# EAGLE design sense_pcb_d (EAGLE 9.6.2)
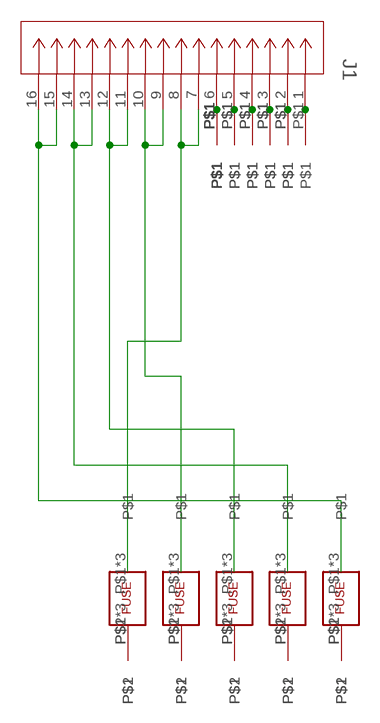
[diagram p0: schematic, sheet 1]

## Parts
J1  DF11-16DP-2DSA(01)  [CONN_DF11-16DP-2DSA(01)_HIR]
U$1  FUSE  [FUSE_PADS]
U$2  FUSE  [FUSE_PADS]
U$3  FUSE  [FUSE_PADS]
U$4  FUSE  [FUSE_PADS]
U$5  FUSE  [FUSE_PADS]
U$6  BB_CONTACT  [BB_CONTACT]
U$7  BB_CONTACT  [BB_CONTACT]
U$8  BB_CONTACT  [BB_CONTACT]
U$9  BB_CONTACT  [BB_CONTACT]
U$10  BB_CONTACT  [BB_CONTACT]
U$12  THERM_PIN  [THERM_PIN]
U$13  THERM_PIN  [THERM_PIN]
U$14  THERM_PIN  [THERM_PIN]
U$15  THERM_PIN  [THERM_PIN]
U$16  THERM_PIN  [THERM_PIN]
U$17  THERM_PIN  [THERM_PIN]
U$18  THERM_PIN  [THERM_PIN]
U$19  THERM_PIN  [THERM_PIN]
U$20  THERM_PIN  [THERM_PIN]
U$22  THERM_PIN  [THERM_PIN]
U$23  THERM_PIN  [THERM_PIN]
U$24  THERM_PIN  [THERM_PIN]
U$25  THERM_PIN  [THERM_PIN]
U$26  THERM_PIN  [THERM_PIN]
U$27  THERM_PIN  [THERM_PIN]
U$28  THERM_PIN  [THERM_PIN]
U$29  THERM_PIN  [THERM_PIN]
U$30  THERM_PIN  [THERM_PIN]

## Nets
N$1: J1.15 J1.16 U$5.P$1 U$5.P$3 U$5.P$5
N$2: U$1.P$2 U$1.P$4 U$1.P$6 U$6.P$1
N$3: J1.7 J1.8 U$1.P$1 U$1.P$3 U$1.P$5
N$4: U$2.P$2 U$2.P$4 U$2.P$6 U$7.P$1
N$5: U$5.P$2 U$5.P$4 U$5.P$6 U$10.P$1
N$6: U$3.P$2 U$3.P$4 U$3.P$6 U$8.P$1
N$7: J1.13 J1.14 U$4.P$1 U$4.P$3 U$4.P$5
N$8: U$4.P$2 U$4.P$4 U$4.P$6 U$9.P$1
N$9: J1.11 J1.12 U$3.P$1 U$3.P$3 U$3.P$5
N$10: J1.9 J1.10 U$2.P$1 U$2.P$3 U$2.P$5
THERM1: J1.5 U$22.P$1 U$23.P$1
THERM2: J1.4 U$24.P$1 U$25.P$1
THERM3: J1.3 U$26.P$1 U$27.P$1
THERM4: J1.2 U$28.P$1 U$29.P$1
THERM5: J1.1 U$30.P$1
THERMGND: J1.6 U$12.P$1 U$13.P$1 U$14.P$1 U$15.P$1 U$16.P$1 U$17.P$1 U$18.P$1 U$19.P$1 U$20.P$1

## Library data of the parts
J1 = sense_pcb_components:DF11-16DP-2DSA(01); COPYRIGHT: Copyright (C) 2023 Ultra Librarian. All rights reserved.; MANUFACTURER_PART_NUMBER: DF11-16DP-2DSA(01); MFR_NAME: Hirose
U$1-U$5 = sense_pcb_components:FUSE
U$6-U$10 = sense_pcb_components:BB_CONTACT
U$12-U$20 U$22-U$30 = sense_pcb_components:THERM_PIN

## Board
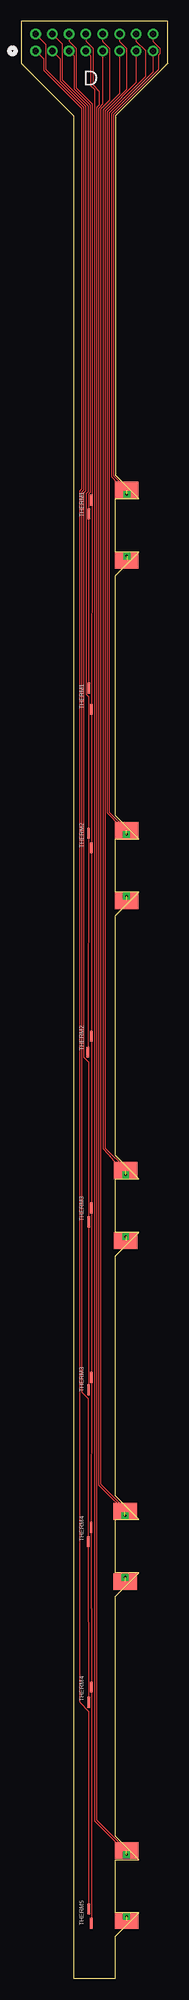
[diagram p1: board, top side]
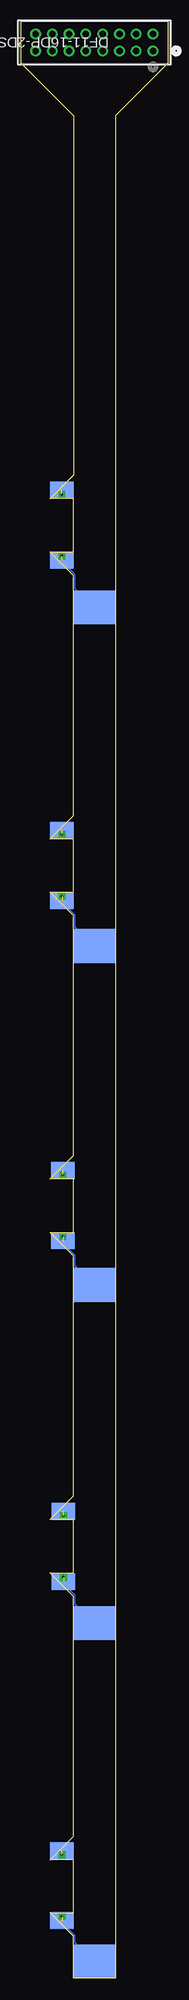
[diagram p2: board, bottom side, seen from below]

Size 17.5 x 233 mm. Coordinates in mm from the lower left corner, seen from the top.
Outline: 11.25,16.95 11.25,45.5 14.05,48.3 11.25,48.3 11.25,54.65 14.05,54.65 11.25,57.45 11.25,86 14.05,88.8 11.25,88.8 11.25,95.15 14.05,95.15 11.25,97.95 11.25,126.5 14.05,129.3 11.25,129.3 11.25,135.65 14.05,135.65 11.25,138.45 11.25,167 14.05,169.8 11.25,169.8 11.25,176.15 14.05,176.15 11.25,178.95 11.25,221.75 17.5,228 17.5,233 0,233 0,228 6.25,221.75 6.25,0 11.25,0 11.25,5 14.05,7.8 11.25,7.8 11.25,14.15 14.05,14.15 11.25,16.95
Copper layers (1*16): Top 0.035mm / dielectric 1.5mm / Bottom 0.035mm
Design rules "small_traces": minimum track width 5mil, minimum drill 0.2mm, track to track 5mil, track to pad 5mil, pad to pad 5mil, via to via 5mil, smd to smd 5mil, copper to edge 6mil, drill to drill 6mil, minimum pad ring 10mil, minimum via ring 0.13mm, stop-mask expansion 4mil, vias tented up to drill 0mil, thermal gap 10mil

### Footprints (pad centres in the part's own frame; a part is rotated, then mirrored left to right if it is on the bottom)
CONN_DF11-16DP-2DSA(01)_HIR = drill 0.762 pad 1.27: 1 0,0; 2 0,-2.007; 3 2.007,0; 4 2.007,-2.007; 5 3.988,0; 6 3.988,-2.007; 7 5.994,0; 8 5.994,-2.007; 9 8.001,0; 10 8.001,-2.007; 11 10.008,0; 12 10.008,-2.007; 13 11.989,0; 14 11.989,-2.007; 15 13.995,0; 16 13.995,-2.007
FUSE_PADS = smd 2.8 x 2 bottom: P$1 0,0; P$2 0,8.35 | smd 2.8 x 2: P$3 0,0; P$4 0,8.35 | drill 0.305 square: P$5 0,0.508; P$6 0,7.842
BB_CONTACT = smd 5 x 4: P$1 0,0
THERM_PIN = smd 0.279 x 1.27: P$1 0,0

### Placement (x,y rotation side)
J1  1.75,229.44 180 bottom
U$1  12.6,15.24 180 top
U$2  12.42,55.6 180 top
U$3  12.5,96.16 180 top
U$4  12.6,136.68 180 top
U$5  12.63,177.16 180 top
U$6  8.79,2.03 0 bottom
U$7  8.79,42.3 0 bottom
U$8  8.79,82.55 0 bottom
U$9  8.79,122.9 0 bottom
U$10  8.79,163.2 0 bottom
U$12  8.41,175.97 0 top
U$13  8.41,151.05 0 top
U$14  8.41,134.59 0 top
U$15  8.41,112.14 0 top
U$16  8.41,91.72 0 top
U$17  8.41,71.55 0 top
U$18  8.36,53.7 0 top
U$19  8.41,34.7 0 top
U$20  8.41,6.58 0 top
U$22  8.08,174.32 0 top
U$23  8.08,153.59 0 top
U$24  8.05,136.3 0 top
U$25  7.98,110.24 0 top
U$26  8.05,70.05 0 top
U$27  8.08,90.04 0 top
U$28  8.03,51.99 0 top
U$29  8.08,32.87 0 top
U$30  8.08,8.28 0 top

### Tracks (layer width: path | path; a pad name or v marks a point on that pad's centre or on a via)
N$1  (2 unrouted)
  Top 0.127: J1.16 15.75,230.61 16.57,229.78 16.57,229.1 16.41,228.93 16.41,227.22 11.03,221.84 11.03,178.86 12.62,177.27 U$5.P$5 10.9,178.64 | 10.9,178.64 10.78,178.75 10.78,221.94 15.75,226.91 J1.15 | 10.9,178.64 11.13,178.41
N$2  (2 unrouted)
  Bottom 0.127: U$6.P$1 11.03,4.28 11.03,5.09 12.6,6.66 U$1.P$6
N$3  (2 unrouted)
  Top 0.127: J1.7 8.32,228.87 8.32,225.29 8.75,224.87 8.75,18.79 11.03,16.51 U$1.P$5 12.6,15.29 9,18.89 9,222.68 9.31,223 9.31,224.66 8.57,225.4 8.57,229.78 7.75,230.61 J1.8
N$4  (2 unrouted)
  Bottom 0.127: U$7.P$1 11.03,44.54 11.03,45.59 12.42,46.98 U$2.P$6
N$5  (2 unrouted)
  Bottom 0.127: U$10.P$1 11.03,165.44 11.03,167.09 12.62,168.68 U$5.P$6
N$6  (2 unrouted)
  Bottom 0.127: U$8.P$1 11.03,84.79 11.03,86.09 12.5,87.55 U$3.P$6
N$7  (2 unrouted)
  Top 0.127: J1.13 13.74,225.63 10.27,222.16 10.27,138.76 10.92,138.12 U$4.P$5 12.6,136.79 10.53,138.87 10.53,222.05 14.84,226.36 14.84,229.51 13.74,230.61 J1.14
N$8  (2 unrouted)
  Bottom 0.127: U$9.P$1 11.03,125.14 11.03,126.59 12.6,128.16 U$4.P$6
N$9  (2 unrouted)
  Top 0.127: 10.4,98.13 9.76,98.77 9.76,222.37 11.76,224.36 J1.11 | 10.4,98.13 10.69,97.84 | J1.12 11.76,230.61 12.59,229.78 12.59,224.83 10.02,222.26 10.02,98.88 12.5,96.4 U$3.P$5 10.4,98.13
N$10  (2 unrouted)
  Top 0.127: 11.11,56.93 9.26,58.78 9.26,222.58 9.75,223.08 J1.9 | 11.11,56.93 11.16,56.88 | J1.10 9.75,230.61 10.58,229.78 10.58,223.54 9.51,222.47 9.51,58.88 12.42,55.97 12.42,55.88 | 12.42,55.88 U$2.P$5 | 11.11,56.93 12.42,55.88
THERM1
  Top 0.127: J1.5 6.31,228.87 6.31,224.97 8.24,223.04 8.24,176.85 8.08,176.69 U$22.P$1 U$23.P$1
THERM2
  Top 0.127: J1.4 4.92,230.29 4.92,226 7.99,222.93 7.99,176.95 7.75,176.71 7.75,152.88 8.05,152.57 U$24.P$1 U$25.P$1
THERM3
  Top 0.127: J1.3 4.66,228.54 4.66,225.9 7.73,222.83 7.73,177.06 7.5,176.82 7.5,109.67 8.08,109.09 U$27.P$1 U$26.P$1
THERM4
  Top 0.127: J1.2 2.94,230.26 2.94,227.27 7.48,222.72 7.48,177.16 7.24,176.93 7.24,69.82 8.03,69.03 U$28.P$1 U$29.P$1
THERM5
  Top 0.127: J1.1 2.68,228.51 2.68,227.16 7.22,222.62 7.22,177.27 6.99,177.03 6.99,32.92 8.08,31.82 U$30.P$1
THERMGND
  Top 0.127: J1.6 5.74,230.61 6.57,229.78 6.57,225.07 8.49,223.14 8.49,176.53 U$12.P$1 8.49,175.89 8.49,173.99 U$13.P$1 U$14.P$1 U$15.P$1 U$16.P$1 8.41,91.44 U$17.P$1 8.36,53.34 | U$18.P$1 8.36,53.34 | 8.36,53.34 U$19.P$1 U$20.P$1

### Text on the board
tPlace: D | THERM1 | THERM1 | THERM2 | THERM2 | THERM3 | THERM3 | THERM4 | THERM4 | THERM5